# EAGLE design design (EAGLE 9.5.2)
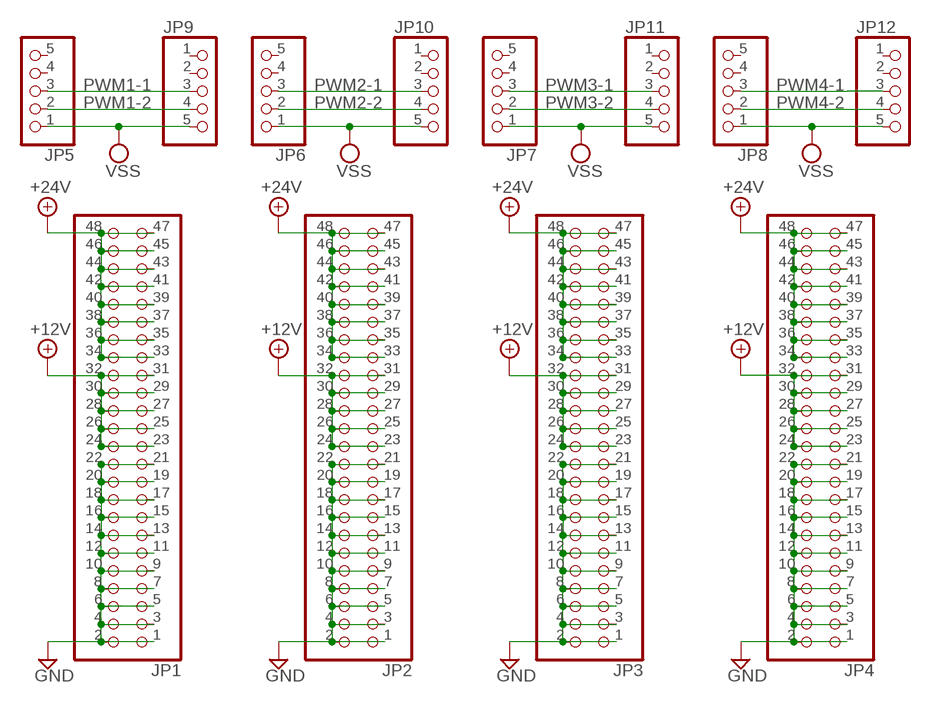
[diagram p0: schematic, sheet 1]

## Parts
JP1  PINHD-2X24  [2X24]
JP2  PINHD-2X24  [2X24]
JP3  PINHD-2X24  [2X24]
JP4  PINHD-2X24  [2X24]
JP5  PINHD-1X5  [1X05]
JP6  PINHD-1X5  [1X05]
JP7  PINHD-1X5  [1X05]
JP8  PINHD-1X5  [1X05]
JP9  PINHD-1X5/90  [1X05/90]
JP10  PINHD-1X5/90  [1X05/90]
JP11  PINHD-1X5/90  [1X05/90]
JP12  PINHD-1X5/90  [1X05/90]

## Nets
+12V: JP1.23 JP1.24 JP1.25 JP1.26 JP1.27 JP1.28 JP1.29 JP1.30 JP1.31 JP1.32 JP2.23 JP2.24 JP2.25 JP2.26 JP2.27 JP2.28 JP2.29 JP2.30 JP2.31 JP2.32 JP3.23 JP3.24 JP3.25 JP3.26 JP3.27 JP3.28 JP3.29 JP3.30 JP3.31 JP3.32 JP4.23 JP4.24 JP4.25 JP4.26 JP4.27 JP4.28 JP4.29 JP4.30 JP4.31 JP4.32
+24V: JP1.33 JP1.34 JP1.35 JP1.36 JP1.37 JP1.38 JP1.39 JP1.40 JP1.41 JP1.42 JP1.43 JP1.44 JP1.45 JP1.46 JP1.47 JP1.48 JP2.33 JP2.34 JP2.35 JP2.36 JP2.37 JP2.38 JP2.39 JP2.40 JP2.41 JP2.42 JP2.43 JP2.44 JP2.45 JP2.46 JP2.47 JP2.48 JP3.33 JP3.34 JP3.35 JP3.36 JP3.37 JP3.38 JP3.39 JP3.40 JP3.41 JP3.42 JP3.43 JP3.44 JP3.45 JP3.46 JP3.47 JP3.48 JP4.33 JP4.34 JP4.35 JP4.36 JP4.37 JP4.38 JP4.39 JP4.40 JP4.41 JP4.42 JP4.43 JP4.44 JP4.45 JP4.46 JP4.47 JP4.48
GND: JP1.1 JP1.2 JP1.3 JP1.4 JP1.5 JP1.6 JP1.7 JP1.8 JP1.9 JP1.10 JP1.11 JP1.12 JP1.13 JP1.14 JP1.15 JP1.16 JP1.17 JP1.18 JP1.19 JP1.20 JP1.21 JP1.22 JP2.1 JP2.2 JP2.3 JP2.4 JP2.5 JP2.6 JP2.7 JP2.8 JP2.9 JP2.10 JP2.11 JP2.12 JP2.13 JP2.14 JP2.15 JP2.16 JP2.17 JP2.18 JP2.19 JP2.20 JP2.21 JP2.22 JP3.1 JP3.2 JP3.3 JP3.4 JP3.5 JP3.6 JP3.7 JP3.8 JP3.9 JP3.10 JP3.11 JP3.12 JP3.13 JP3.14 JP3.15 JP3.16 JP3.17 JP3.18 JP3.19 JP3.20 JP3.21 JP3.22 JP4.1 JP4.2 JP4.3 JP4.4 JP4.5 JP4.6 JP4.7 JP4.8 JP4.9 JP4.10 JP4.11 JP4.12 JP4.13 JP4.14 JP4.15 JP4.16 JP4.17 JP4.18 JP4.19 JP4.20 JP4.21 JP4.22
PWM1-1: JP5.3 JP9.3
PWM1-2: JP5.2 JP9.4
PWM2-1: JP6.3 JP10.3
PWM2-2: JP6.2 JP10.4
PWM3-1: JP7.3 JP11.3
PWM3-2: JP7.2 JP11.4
PWM4-1: JP8.3 JP12.3
PWM4-2: JP8.2 JP12.4
VSS: JP5.1 JP6.1 JP7.1 JP8.1 JP9.5 JP10.5 JP11.5 JP12.5
Unconnected: JP5.4 JP5.5 JP6.4 JP6.5 JP7.4 JP7.5 JP8.4 JP8.5 JP9.1 JP9.2 JP10.1 JP10.2 JP11.1 JP11.2 JP12.1 JP12.2

## Library data of the parts
JP1-JP4 = pinhead:PINHD-2X24: PIN HEADER
JP5-JP12 = pinhead:PINHD-1X5: PIN HEADER

## Board
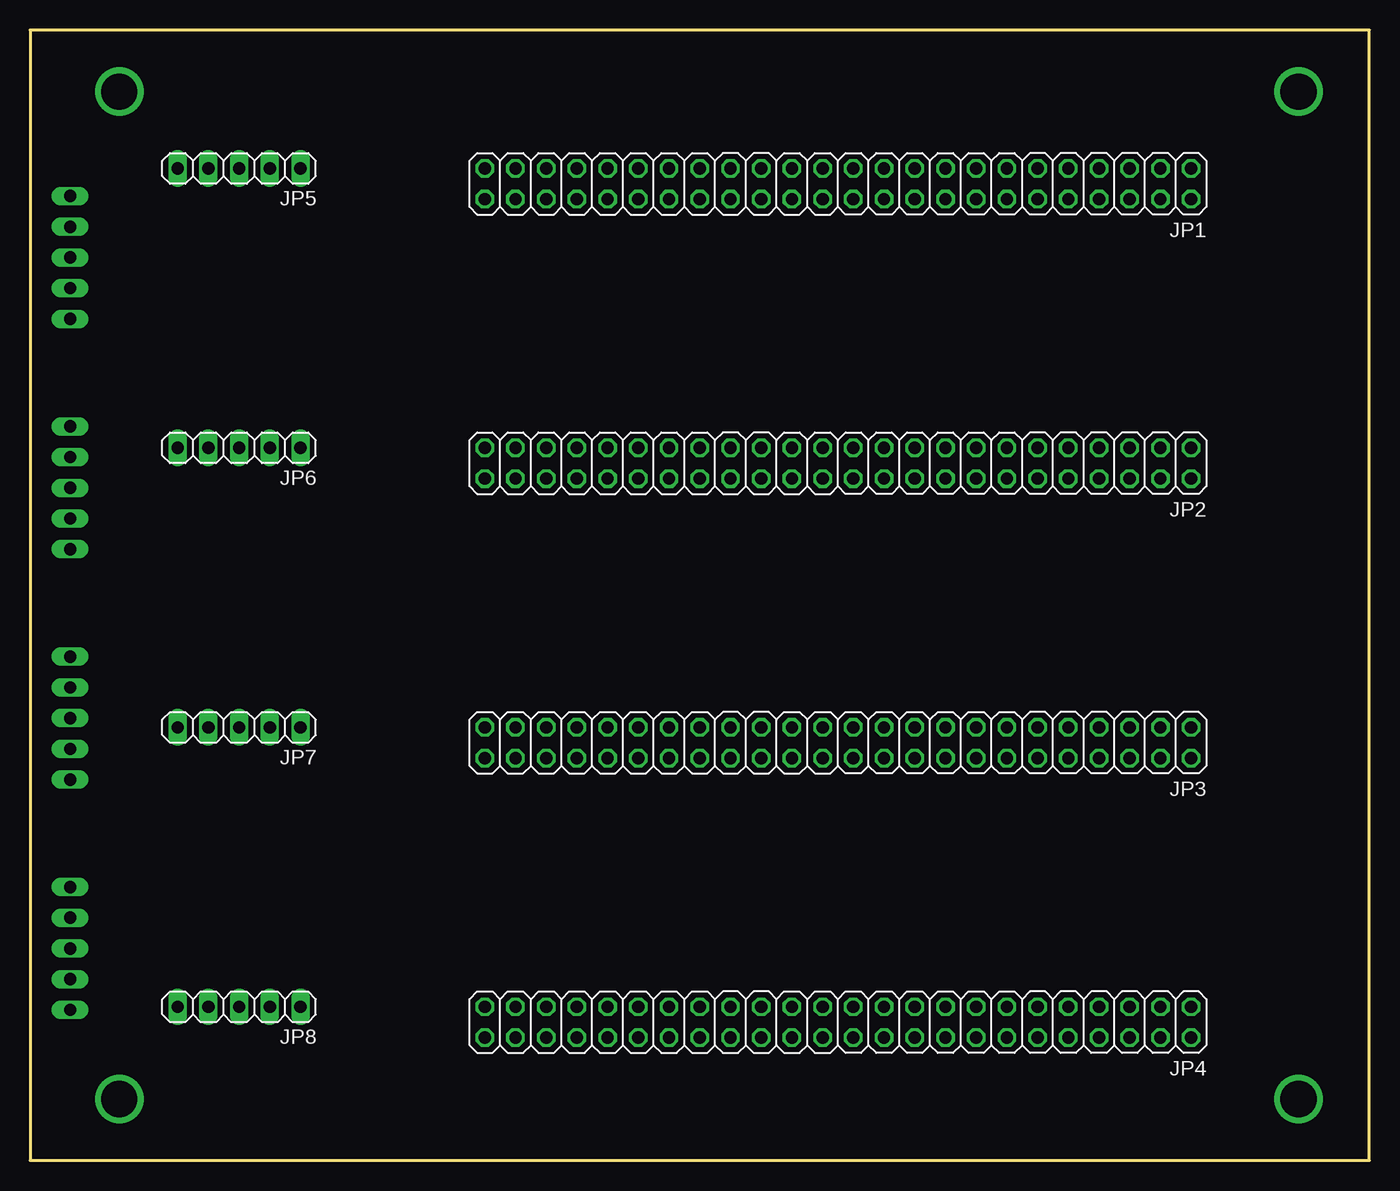
[diagram p1: board, top side]
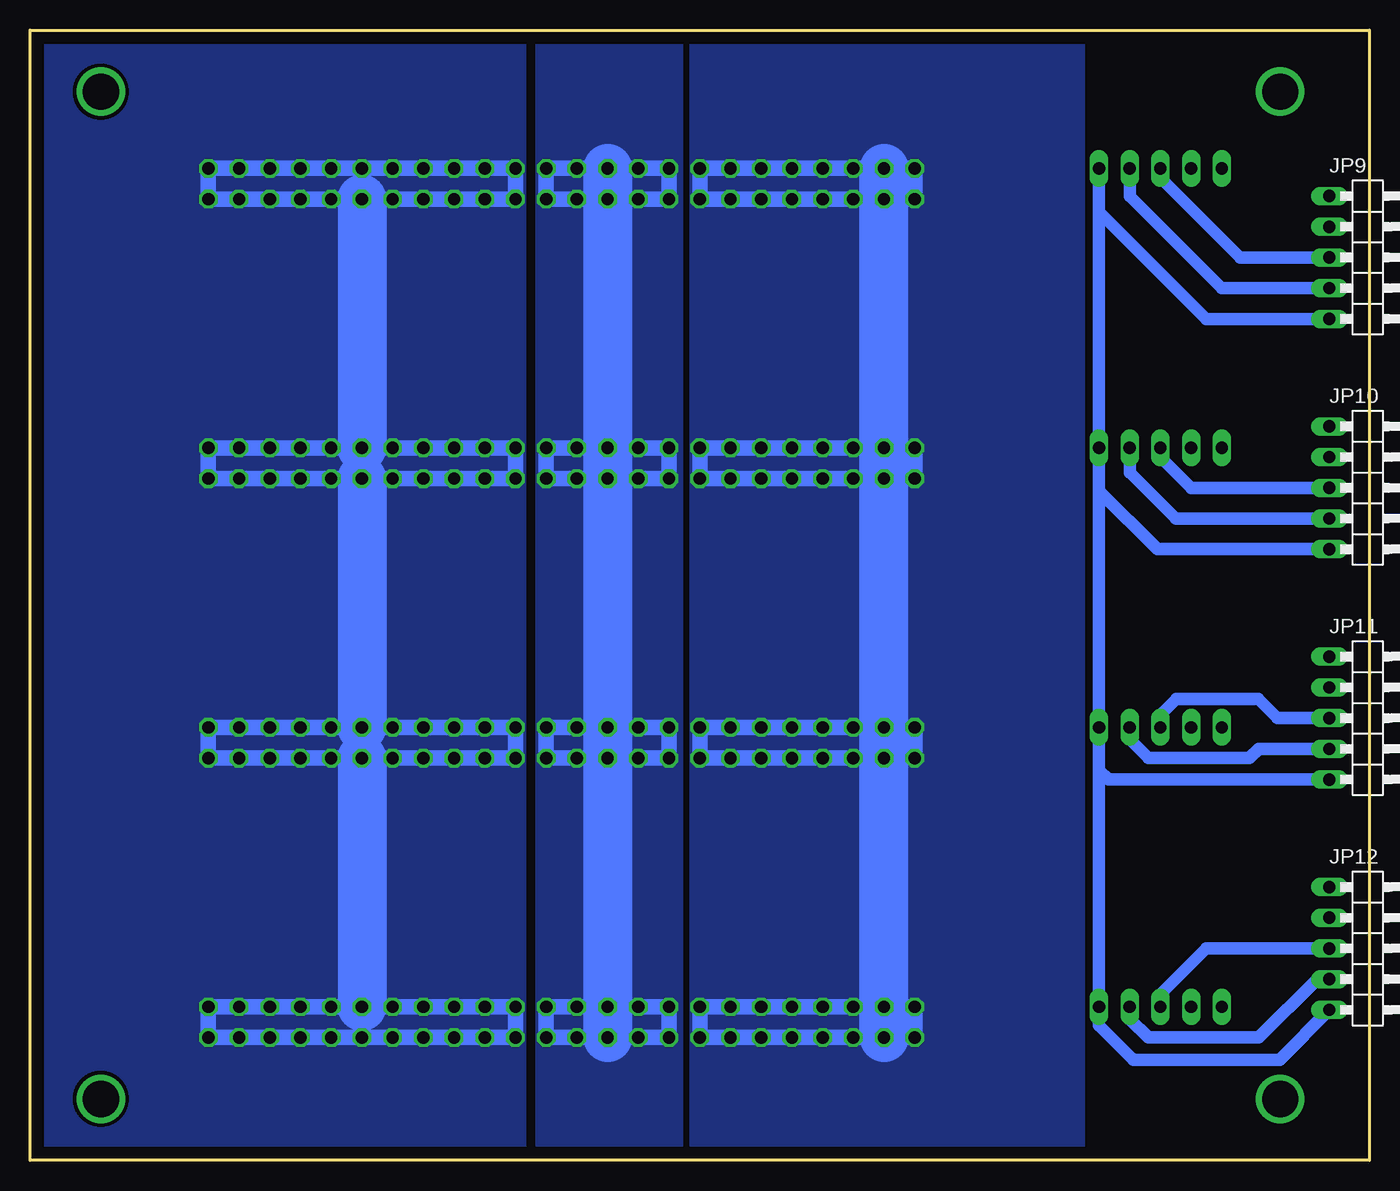
[diagram p2: board, bottom side, seen from below]

Size 110.74 x 93.47 mm. Coordinates in mm from the lower left corner, seen from the top.
Outline: 0,93.47 0,0 110.74,0 110.74,93.47 0,93.47
Copper layers (1*16): Top 0.035mm / dielectric 1.5mm / Bottom 0.035mm
Design rules "default *": minimum track width 6mil, minimum drill 0.35mm, track to track 0.3mm, track to pad 0.3mm, pad to pad 0.3mm, via to via 0.3mm, smd to smd 0.3mm, copper to edge 40mil, drill to drill 6mil, minimum pad ring 10mil, minimum via ring 8mil, stop-mask expansion 4mil, vias tented up to drill 0mil, thermal gap 10mil

### Footprints (pad centres in the part's own frame; a part is rotated, then mirrored left to right if it is on the bottom)
2X24 = drill 1.016 octagon: 1 -27.94,-1.27; 2 -27.94,1.27; 3 -25.4,-1.27; 4 -25.4,1.27; 5 -22.86,-1.27; 6 -22.86,1.27; 7 -20.32,-1.27; 8 -20.32,1.27; 9 -17.78,-1.27; 10 -17.78,1.27; 11 -15.24,-1.27; 12 -15.24,1.27; 13 -12.7,-1.27; 14 -12.7,1.27; 15 -10.16,-1.27; 16 -10.16,1.27; 17 -7.62,-1.27; 18 -7.62,1.27; 19 -5.08,-1.27; 20 -5.08,1.27; 21 -2.54,-1.27; 22 -2.54,1.27; 23 0,-1.27; 24 0,1.27; 25 2.54,-1.27; 26 2.54,1.27; 27 5.08,-1.27; 28 5.08,1.27; 29 7.62,-1.27; 30 7.62,1.27; 31 10.16,-1.27; 32 10.16,1.27; 33 12.7,-1.27; 34 12.7,1.27; 35 15.24,-1.27; 36 15.24,1.27; 37 17.78,-1.27; 38 17.78,1.27; 39 20.32,-1.27; 40 20.32,1.27; 41 22.86,-1.27; 42 22.86,1.27; 43 25.4,-1.27; 44 25.4,1.27; 45 27.94,-1.27; 46 27.94,1.27; 47 30.48,-1.27; 48 30.48,1.27
1X05 = drill 1.016 long: 1 -5.08,0; 2 -2.54,0; 3 0,0; 4 2.54,0; 5 5.08,0
1X05/90 = drill 1.016 long: 1 -5.08,-3.81; 2 -2.54,-3.81; 3 0,-3.81; 4 2.54,-3.81; 5 5.08,-3.81

### Placement (x,y rotation side)
JP1  68.07,80.77 180 top
JP2  68.07,57.66 180 top
JP3  68.07,34.54 180 top
JP4  68.07,11.43 180 top
JP5  17.27,82.04 180 top
JP6  17.27,58.93 180 top
JP7  17.27,35.81 180 top
JP8  17.27,12.7 180 top
JP9  -0.51,74.68 270 bottom
JP10  -0.51,55.63 270 bottom
JP11  -0.51,36.58 270 bottom
JP12  -0.51,17.53 270 bottom

### Tracks (layer width: path | path; a pad name or v marks a point on that pad's centre or on a via)
+12V
  Bottom 1.27: JP1.31 JP1.32 JP1.30 JP1.28 JP1.26 JP1.24 JP1.23 JP1.25 JP1.27 JP1.29 JP1.31 | JP2.31 JP2.32 JP2.30 JP2.28 JP2.26 JP2.24 JP2.23 JP2.25 JP2.27 JP2.29 JP2.31 | JP3.31 JP3.32 JP3.30 JP3.28 JP3.26 JP3.24 JP3.23 JP3.25 JP3.27 JP3.29 JP3.31 | JP4.31 JP4.32 JP4.30 JP4.28 JP4.26 JP4.24 JP4.23 JP4.25 JP4.27 JP4.29 JP4.31
  Bottom 4.064: JP1.27 JP2.28 JP3.28 JP4.28
  pour Bottom (no thermals): 56.9,94.23 56.9,-1.02 68.83,-1.02 68.83,94.23
+24V
  Bottom 1.27: JP1.47 JP1.45 JP1.43 JP1.41 JP1.39 JP1.37 JP1.35 JP1.33 JP1.34 JP1.36 JP1.38 JP1.40 JP1.42 JP1.44 JP1.46 JP1.48 JP1.47 | JP2.47 JP2.48 JP2.46 JP2.44 JP2.42 JP2.40 JP2.38 JP2.36 JP2.34 JP2.33 JP2.35 JP2.37 JP2.39 JP2.41 JP2.43 JP2.45 JP2.47 | JP3.47 JP3.48 JP3.46 JP3.44 JP3.42 JP3.40 JP3.38 JP3.36 JP3.34 JP3.33 JP3.35 JP3.37 JP3.39 JP3.41 JP3.43 JP3.45 JP3.47 | JP4.47 JP4.48 JP4.46 JP4.44 JP4.42 JP4.40 JP4.38 JP4.36 JP4.34 JP4.33 JP4.35 JP4.37 JP4.39 JP4.41 JP4.43 JP4.45 JP4.47
  Bottom 4.064: JP4.46 JP3.46 JP2.46 JP1.45
  pour Bottom (no thermals): 56.13,-1.02 23.62,-1.02 23.62,94.23 56.13,94.23
GND
  Bottom 1.27: JP1.2 JP1.1 JP1.3 JP1.5 JP1.7 JP1.9 JP1.11 JP1.13 JP1.15 JP1.17 JP1.19 JP1.21 JP1.22 JP1.20 JP1.18 JP1.16 JP1.14 JP1.12 JP1.10 JP1.8 JP1.6 JP1.4 JP1.2 | JP2.22 JP2.20 JP2.18 JP2.16 JP2.14 JP2.12 JP2.10 JP2.8 JP2.6 JP2.4 JP2.2 JP2.1 JP2.3 JP2.5 JP2.7 JP2.9 JP2.11 JP2.13 JP2.15 JP2.17 JP2.19 JP2.21 JP2.22 | JP3.21 JP3.22 JP3.20 JP3.18 JP3.16 JP3.14 JP3.12 JP3.10 JP3.8 JP3.6 JP3.4 JP3.2 JP3.1 JP3.3 JP3.5 JP3.7 JP3.9 JP3.11 JP3.13 JP3.15 JP3.17 JP3.19 JP3.21 | JP4.21 JP4.22 JP4.20 JP4.18 JP4.16 JP4.14 JP4.12 JP4.10 JP4.8 JP4.6 JP4.4 JP4.2 JP4.1 JP4.3 JP4.5 JP4.7 JP4.9 JP4.11 JP4.13 JP4.15 JP4.17 JP4.19 JP4.21
  Bottom 4.064: JP1.12 JP2.11 | JP2.12 JP3.11 | JP3.12 JP4.11
  pour Bottom (no thermals): 69.85,92.96 69.85,0.51 69.85,-1.02 113.28,-1.02 113.28,94.23 69.85,94.23
N$1  (via drill 3)
  other vias: 104.9,88.39
N$2  (via drill 3)
  other vias: 104.9,5.08
N$3  (via drill 3)
  other vias: 7.37,88.39
N$4  (via drill 3)
  other vias: 7.37,5.08
PWM1-1
  Bottom 1.016: JP9.3 10.67,74.68 17.27,81.28 JP5.3
PWM1-2
  Bottom 1.016: JP9.4 12.19,72.14 19.81,79.76 JP5.2
PWM2-1
  Bottom 1.016: JP10.3 14.73,55.63 17.27,58.17 JP6.3
PWM2-2
  Bottom 1.016: JP10.4 16,53.09 19.81,56.9 JP6.2
PWM3-1
  Bottom 1.016: JP11.3 7.62,36.58 9.19,38.15 15.96,38.15 17.27,36.83 JP7.3
PWM3-2
  Bottom 1.016: JP11.4 9.14,34.04 9.91,33.27 18.29,33.27 19.81,34.8 JP7.2
PWM4-1
  Bottom 1.016: JP12.3 13.46,17.53 17.27,13.72 JP8.3
PWM4-2
  Bottom 1.016: JP8.2 19.81,11.68 18.29,10.16 9.14,10.16 4.32,14.99 JP12.4
VSS
  Bottom 1.016: JP9.5 13.46,69.6 22.35,78.49 | 22.35,78.49 JP5.1 | JP10.5 17.53,50.55 22.35,55.37 | 22.35,55.37 JP6.1 22.35,78.49 | JP11.5 21.59,31.5 22.35,32.26 | 22.35,32.26 JP7.1 22.35,55.37 | 22.35,32.26 JP8.1 22.35,11.18 19.51,8.34 7.41,8.34 JP12.5